# Altium schematic sheet 2_MCU.SchDoc
size A3; DocumentNumber: 3; SheetNumber: 3; SheetTotal: 6; PageSetup: Record=PageOptions|CenterHorizontal=True|CenterVertical=True|PrintScale=1.01|XCorrection=1.00|YCorrection=1.00|PrintKind=0|BorderSize=5000000|LeftOffset=0|BottomOffset=0|Orientation=2|PaperLength=1000|PaperWidth=1000|Scale=100|PaperSource=7|PrintQuality=-4|MediaType=1|DitherType=10|PaperKind=A3|PrintScaleMode=1
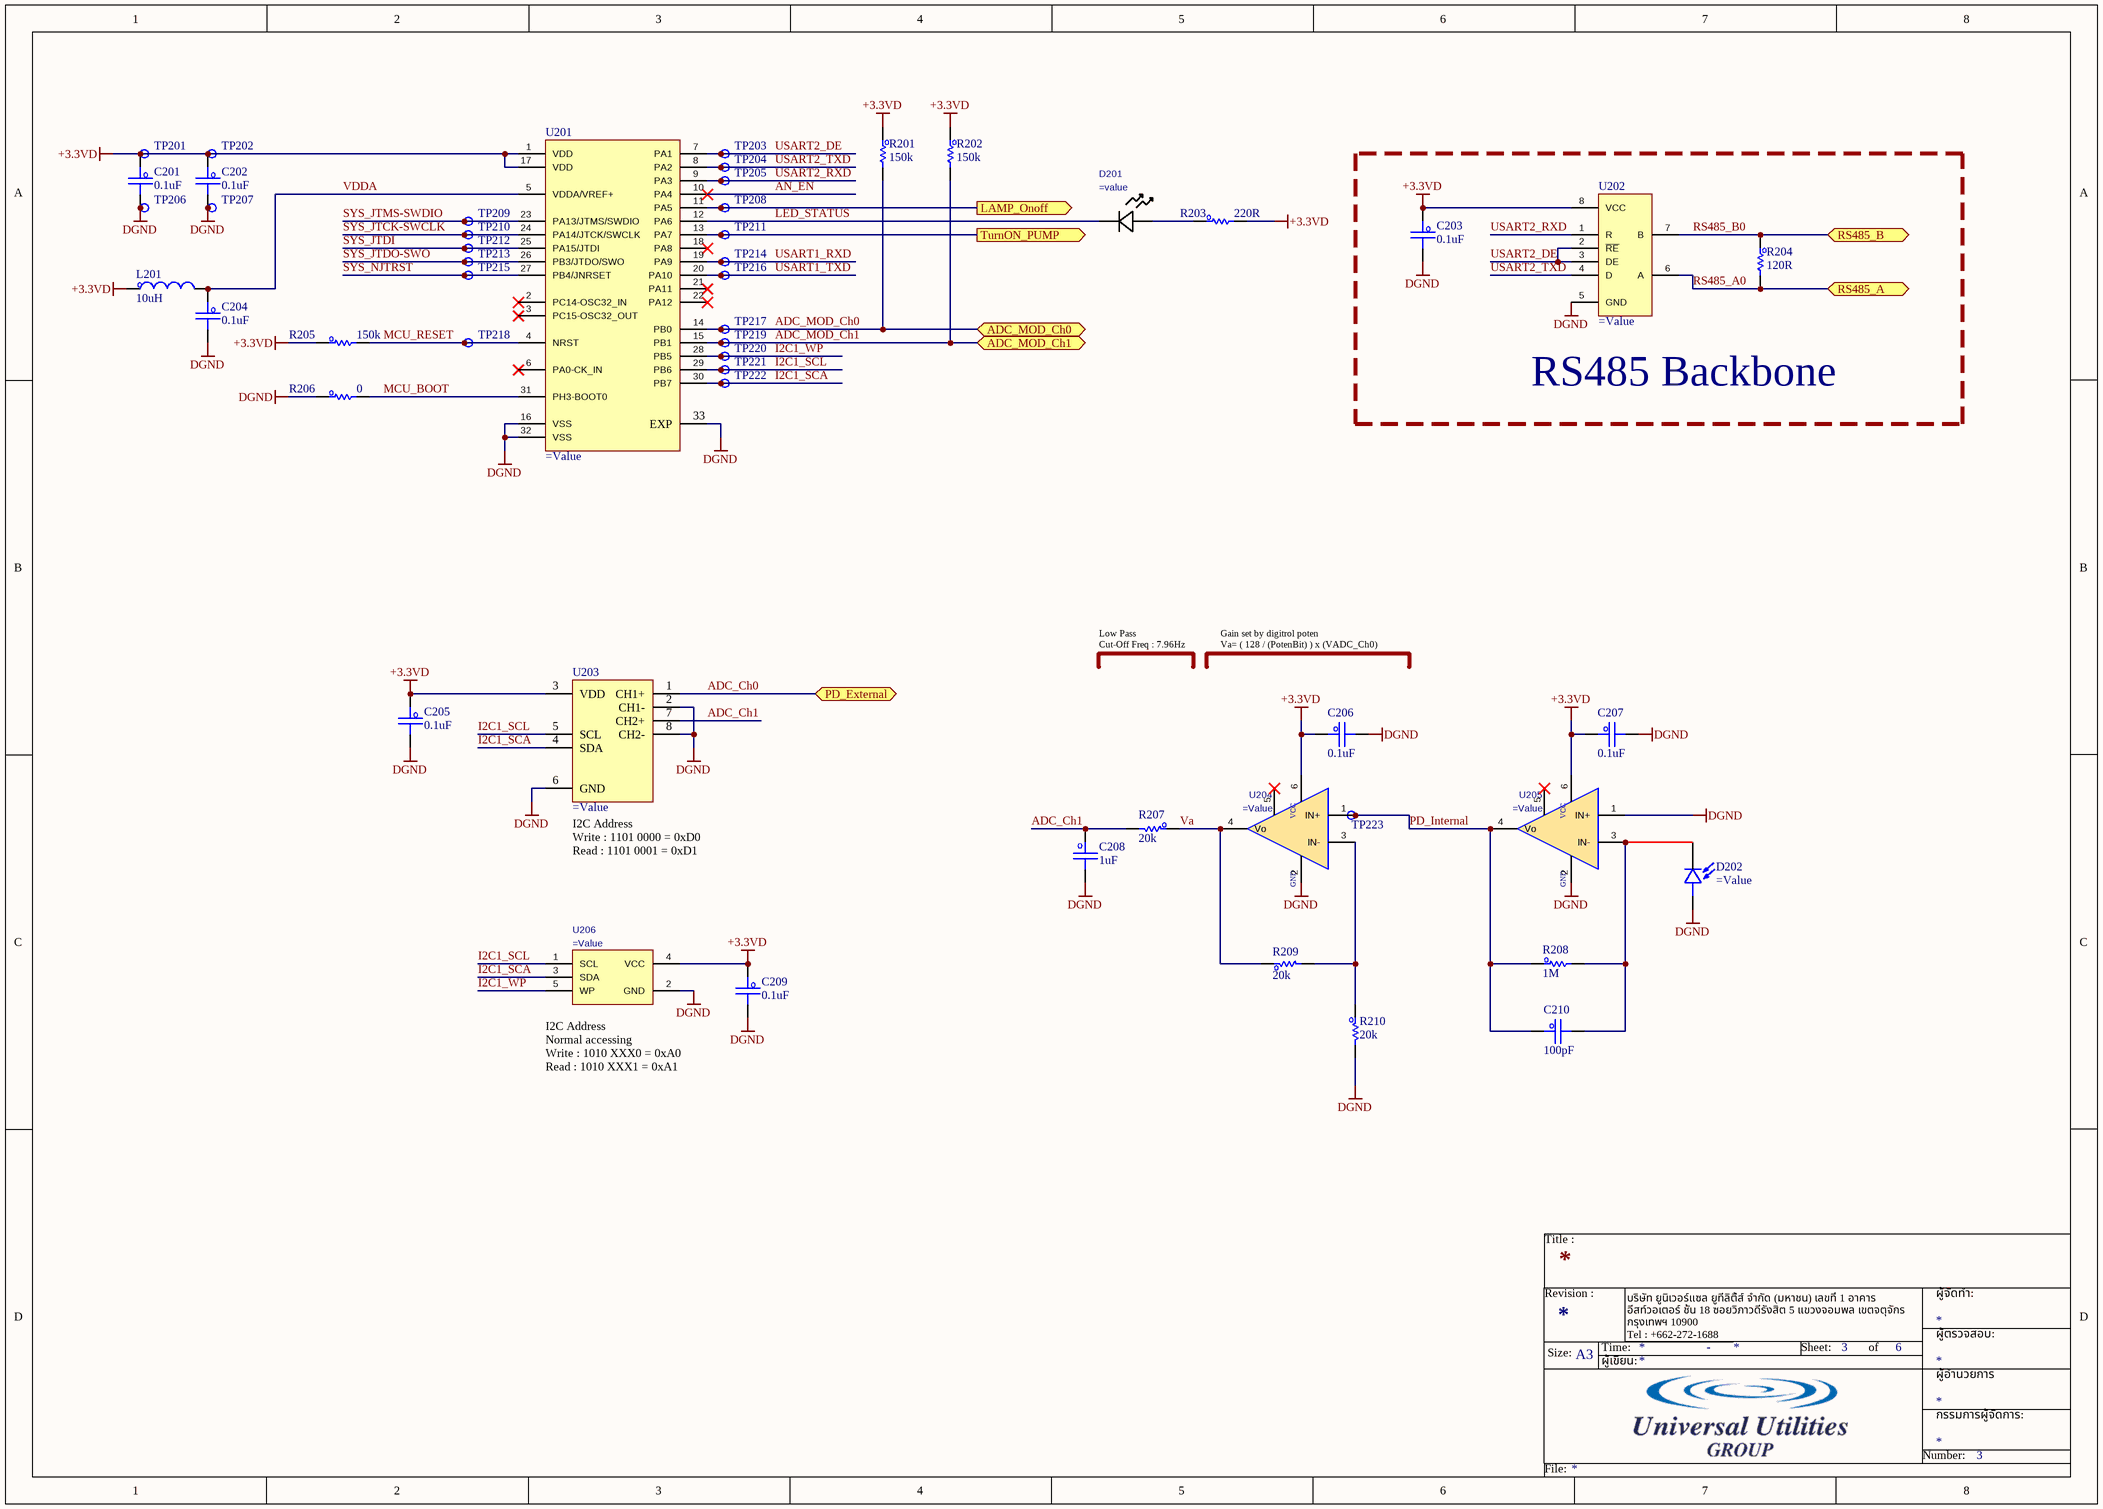
[diagram p0: 2_MCU.SchDoc]

## Parts
C201  0.1uF  [C_0603]
C202  0.1uF  [C_0603]
C203  0.1uF  [C_0603]
C204  0.1uF  [C_0603]
C205  0.1uF  [C_0603]
C206  0.1uF  [C_0603]
C207  0.1uF  [C_0603]
C208  1uF  [C_0603]
C209  0.1uF  [C_0603]
C210  100pF  [C_0603]
D201  (no value)  [LED_0VS75000_WRE]
D202  (no value)  [TO254P950H570-2]
L201  10uH  [L_0402]
R201  150k  [R_0603]
R202  150k  [R_0603]
R203  220R  [R_0603]
R204  120R  [R_0603]
R205  150k  [R_0603]
R206  0  [R_0603]
R207  20k  [R_0603]
R208  1M  [R_0603]
R209  20k  [R_0603]
R210  20k  [R_0603]
TP201  (no value)  [TP_Testpoint]  (no BOM)
TP202  (no value)  [TP_Testpoint]  (no BOM)
TP203  (no value)  [TP_Testpoint]  (no BOM)
TP204  (no value)  [TP_Testpoint]  (no BOM)
TP205  (no value)  [TP_Testpoint]  (no BOM)
TP206  (no value)  [TP_Testpoint]  (no BOM)
TP207  (no value)  [TP_Testpoint]  (no BOM)
TP208  (no value)  [TP_Testpoint]  (no BOM)
TP209  (no value)  [TP_Testpoint]  (no BOM)
TP210  (no value)  [TP_Testpoint]  (no BOM)
TP211  (no value)  [TP_Testpoint]  (no BOM)
TP212  (no value)  [TP_Testpoint]  (no BOM)
TP213  (no value)  [TP_Testpoint]  (no BOM)
TP214  (no value)  [TP_Testpoint]  (no BOM)
TP215  (no value)  [TP_Testpoint]  (no BOM)
TP216  (no value)  [TP_Testpoint]  (no BOM)
TP217  (no value)  [TP_Testpoint]  (no BOM)
TP218  (no value)  [TP_Testpoint]  (no BOM)
TP219  (no value)  [TP_Testpoint]  (no BOM)
TP220  (no value)  [TP_Testpoint]  (no BOM)
TP221  (no value)  [TP_Testpoint]  (no BOM)
TP222  (no value)  [TP_Testpoint]  (no BOM)
TP223  (no value)  [TP_Testpoint]  (no BOM)
U201  (no value)  [QFN50P500X500X60-33N]
U202  (no value)  [SOP65P490X110-8N]
U203  (no value)  [SON50P200X300X100-9N]
U204  (no value)  [SOT65P210X110-6N]
U205  (no value)  [SOT65P210X110-6N]
U206  (no value)  [SOT65P210X110-5N]

## Blocks framed on the sheet
RS485 Backbone: C203 R204 U202

## Ports
ADC_MOD_Ch0 (bidir), ADC_MOD_Ch1 (bidir), LAMP_Onoff (out), PD_External (bidir), RS485_A (bidir), RS485_B (bidir), TurnON_PUMP (out)

## Nets
+3.3VD: C201.1 C202.1 C203.1 C205.1 C206.1 C207.1 C209.1 L201.1 R201.1 R202.1 R203.2 R205.1 TP201.1 TP202.1 U201.1(VDD) U201.17(VDD) U202.8(VCC) U203.3(VDD) U204.6(VDD) U205.6(VDD) U206.4(VCC)
DGND: C201.2 C202.2 C203.2 C204.2 C205.2 C206.2 C207.2 C208.2 C209.2 D202.A R206.1 R210.2 TP206.1 TP207.1 U201.16(VSS) U201.32(VSS) U201.33(EXP) U202.5(GND) U203.2(CH1-) U203.6(GND) U203.8(CH2-) U204.2(GND) U205.1(IN+) U205.2(GND) U206.2(GND)
ADC_Ch0: U203.1(CH1+) ; port PD_External
ADC_Ch1: C208.1 R207.2 U203.7(CH2+)
ADC_MOD_Ch0: R201.2 TP217.1 U201.14(PB0) ; port ADC_MOD_Ch0
ADC_MOD_Ch1: R202.2 TP219.1 U201.15(PB1) ; port ADC_MOD_Ch1
AN_EN: U201.10(PA4)
I2C1_SCA: TP222.1 U201.30(PB7) U203.4(SDA) U206.3(SDA)
I2C1_SCL: TP221.1 U201.29(PB6) U203.5(SCL) U206.1(SCL)
I2C1_WP: TP220.1 U201.28(PB5) U206.5(WP)
LAMP_Onoff: TP208.1 U201.11(PA5) ; port LAMP_Onoff
LED_STATUS: D201.2 U201.12(PA6)
MCU_BOOT: R206.2 U201.31(PH3-BOOT0)
MCU_RESET: R205.2 TP218.1 U201.4(NRST)
PD_Internal: C210.1 R208.1 TP223.1 U204.1(IN+) U205.4(Vo)
RS485_A0: R204.2 U202.6(A) ; port RS485_A
RS485_B0: R204.1 U202.7(B) ; port RS485_B
SYS_JTCK-SWCLK: TP210.1 U201.24(PA14/JTCK/SWCLK)
SYS_JTDI: TP212.1 U201.25(PA15/JTDI)
SYS_JTDO-SWO: TP213.1 U201.26(PB3/JTDO/SWO)
SYS_JTMS-SWDIO: TP209.1 U201.23(PA13/JTMS/SWDIO)
SYS_NJTRST: TP215.1 U201.27(PB4/JNRSET)
TurnON_PUMP: TP211.1 U201.13(PA7) ; port TurnON_PUMP
USART1_RXD: TP214.1 U201.19(PA9)
USART1_TXD: TP216.1 U201.20(PA10)
USART2_DE: TP203.1 U201.7(PA1) U202.2(~{RE}) U202.3(DE)
USART2_RXD: TP205.1 U201.9(PA3) U202.1(R)
USART2_TXD: TP204.1 U201.8(PA2) U202.4(D)
Va: R207.1 R209.1 U204.4(Vo)
VDDA: C204.1 L201.2 U201.5(VDDA/VREF+)
NetC210_2: C210.2 D202.C R208.2 U205.3(IN-)
NetD201_1: D201.1 R203.1
NetR209_2: R209.2 R210.1 U204.3(IN-)

Not connected (* = marked no-connect by the designer): U201 2(PC14-OSC32_IN)* 3(PC15-OSC32_OUT)* 6(PA0-CK_IN)* 18(PA8)* 21(PA11)* 22(PA12)*; U204 5(Vo)*; U205 5(Vo)*

## Notes on the sheet
- Low Pass
  Cut-Off Freq : 7.96Hz
- Gain set by digitrol poten
  Va= ( 128 / (PotenBit) ) x (VADC_Ch0)
- (near U203) I2C Address
  Write : 1101 0000 = 0xD0
  Read : 1101 0001 = 0xD1
- (near U206) I2C Address
  Normal accessing
  Write : 1010 XXX0 = 0xA0
  Read : 1010 XXX1 = 0xA1
- Title :
- Revision :
- ผู้จัดทำ:
- Size:
- A3
- Time:
- ผู้เขียน:
- บริษัท ยูนิเวอร์แซล ยูทีลิตี้ส์ จำกัด (มหาชน) เลขที่ 1 อาคาร อีสท์วอเตอร์ ชั้น 18 ซอยวิภาวดีรังสิต 5 แขวงจอมพล เขตจตุจักร กรุงเทพฯ 10900
  Tel : +662-272-1688
  Fax :+662-2721690-1
- -
- Sheet:
- of
- ผู้อำนวยการ
- ผู้ตรวจสอบ:
- Number:
- กรรมการผู้จัดการ:
- File:
- (in symbol IC_OPAMP_OPA607) VCC

## Library data of the parts
C201-C207 C209 = C_Capacitor: CAP CER 0.1UF 50V X7R 0603; Manufacturer: KEMET; PartNumber: C0603C104K5RACTU; PackageReference: 0603; PartID: 399-5089-1-ND; Value2: 50V; Value: 0.1uF; Value3: *
C208 = C_Capacitor: CAP CER 0603 1UF 6.3V X7R 5%; Manufacturer: KEMET; PartNumber: C0603X105J9RAC7867; PackageReference: 0603; PartID: 399-17700-1-ND; Value2: 6.3V; Value: 1uF; Value3: X7R
C210 = C_Capacitor: CAP CER 100PF 100V X7R 0603; Manufacturer: AVX Corporation; PartNumber: 06031C101JAT2A; Value3: ±5%; PackageReference: 0603; PartID: 478-12671-1-ND; Value2: 100V; Value: 100pF
D201 = D_LED_150060BS75000: LED BLUE CLEAR 0603 SMD; Manufacturer: Wurth Electronics; Value: 150060VS75000; PackageReference: 0603; PartID: 732-4980-1-ND; PartNumber: 150060VS75000
D202 = D_PD_BPX61: SENSOR PHOTODIODE 850NM TO39-2; PartNumber: BPX 61; Manufacturer: OSRAM Opto Semiconductors Inc.; Value: BPX 61; PartID: 475-1350-ND; PackageReference: *; Value3: *
L201 = L_Inductor: 10µH Shielded Multilayer Inductor 250mA 1.05Ohm 0603 (1608 Metric); Manufacturer: TDK Corporation; PartNumber: MLZ1608M100WT000; Value: 10uH; PackageReference: 0603; PartID: 445-6389-1-ND; Value3: *
R201 R202 R205 = R_Resister: RES SMD 150K OHM 1% 1/10W 0603; Manufacturer: Vishay Dale; PartNumber: CRCW0603150KFKEAC; Value2: 0.1W; Value: 150k; PackageReference: 0603; PartID: 541-4034-1-ND; Value3: *
R203 = R_Resister: RES SMD 220 OHM 1% 1/10W 0603; Manufacturer: Vishay Dale; PartNumber: CRCW0603220RFKEAC; Value2: 0.1W; Value: 220R; PackageReference: 0603; PartID: 541-4047-1-ND; Value3: *
R204 = R_Resister: RES SMD 120 OHM 1% 1/3W 0603; Manufacturer: Vishay Dale; PartNumber: CRCW0603120RFKEAHP; Value2: 0.333W; Value: 120R; PackageReference: 0603; PartID: 541-120SCT-ND; Value3: *
R206 = R_Resister: RES SMD 0 OHM JUMP 1/10W 0603; Manufacturer: Vishay Dale; PartNumber: CRCW06030000Z0EBC; Value2: 0.1W; Value: 0; PackageReference: 0603; PartID: 541-4013-1-ND; Value3: *
R207 R209 R210 = R_Resister: RES SMD 20K OHM 5% 1/4W 0603; Manufacturer: Panasonic Electronic Components; PartNumber: ERJ-PA3J203V; Value2: 0.1W; Value: 20k; PackageReference: 0603; PartID: P20KBZCT-ND; Value3: *
R208 = R_Resister: RES SMD 1M OHM 5% 1/10W 0603; Manufacturer: YAGEO; PartNumber: AC0603JR-071ML; Value2: 0.1W; Value: 1M; PackageReference: 0603; PartID: 311-1MLECT-ND; Value3: 5%
TP201-TP223 = TP_TestPoint: TestPoint; Manufacturer: *; PackageReference: *; PartID: *; PartNumber: *; Value2: *; Value3: *
U201 = IC_MCU_STM32L432: IC MCU 32BIT 256KB FLSH 32UFQFPN; PartNumber: STM32L432KCU6; Manufacturer: STMicroelectronics; Value: STM32L432KCU6; PartID: 497-16578-ND; PackageReference: *; Value2: *; Value3: *
U202 = IC_TRAN_SN65HVD78DGK: IC TRANSCEIVER FULL 1/1 8VSSOP; PartNumber: SN65HVD77DGKR; Manufacturer: Texas Instruments; Value: SN65HVD77DGKR; PartID: 296-40528-1-ND; PackageReference: VSSOP-8; Value2: *; Value3: *
U203 = IC_ADC_MCP3422A0: IC ADC 18BIT SIGMA-DELTA 8DFN; PartNumber: MCP3422A0-E/MC; Manufacturer: Microchip Technology; Value: MCP3422A0-E/MC; PartID: MCP3422A0-E/MC-ND; PackageReference: DFN-8; Value2: *; Value3: *
U204 U205 = IC_OPAMP_OPA607: LOW POWER, PRECISION, 50 MHZ DEC; Manufacturer: Texas Instruments; Value: OPA607IDCKR; PackageReference: SC-70-6; PartID: 296-OPA607IDCKRCT-ND; PartNumber: OPA607IDCKR
U206 = IC_MEM_24AA02HT: IC EEPROM 2KBIT I2C SC70-5; Manufacturer: Microchip Technology; Value: 24AA02HT-I/LT; PackageReference: SC-70-5; PartID: 24AA02HT-I/LTCT-ND; PartNumber: 24AA02HT-I/LT